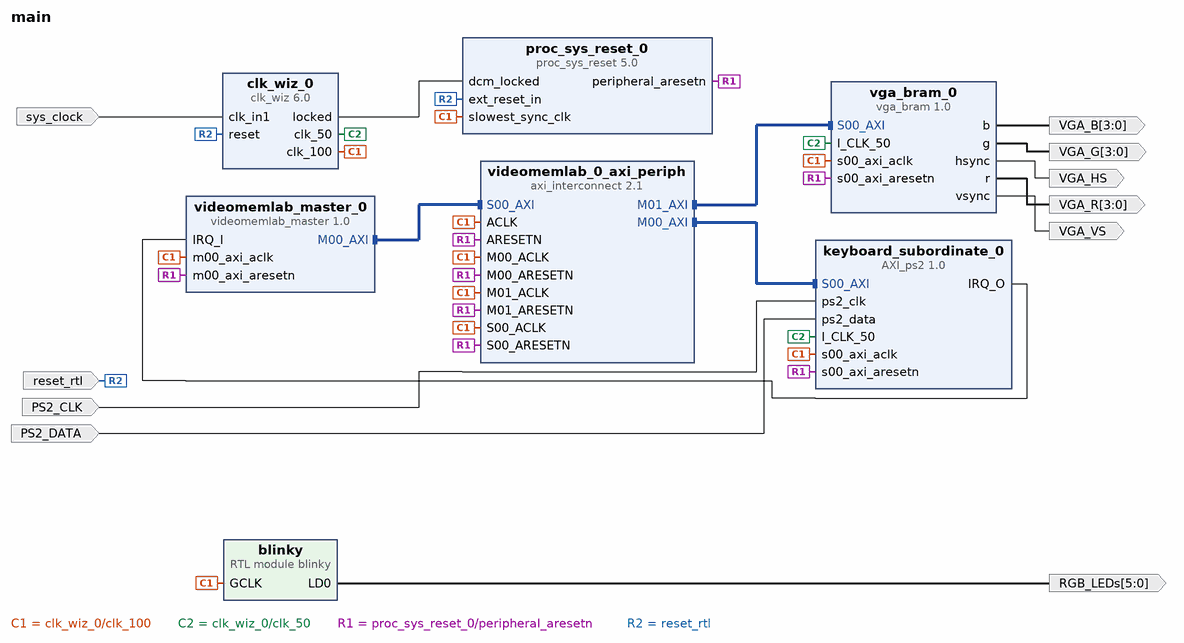
[diagram p0: block diagram of the top level]
# Vivado block design main, xc7z007sclg400-1, Vivado 2022.2
create_bd_design main

create_bd_port -dir I -type rst reset_rtl
set_property -dict {CONFIG.POLARITY ACTIVE_HIGH} [get_bd_ports reset_rtl]
create_bd_port -dir O -from 5 -to 0 RGB_LEDs
create_bd_port -dir I -type clk sys_clock
set_property -dict {CONFIG.FREQ_HZ 125000000 CONFIG.PHASE 0.0} [get_bd_ports sys_clock]
create_bd_port -dir I PS2_CLK
create_bd_port -dir I PS2_DATA
create_bd_port -dir O -from 3 -to 0 VGA_B
create_bd_port -dir O -from 3 -to 0 VGA_G
create_bd_port -dir O -from 3 -to 0 VGA_R
create_bd_port -dir O VGA_VS
create_bd_port -dir O VGA_HS

create_bd_cell -type ip -vlnv xilinx.com:ip:proc_sys_reset:5.0 proc_sys_reset_0
create_bd_cell -type ip -vlnv xilinx.com:ip:clk_wiz:6.0 clk_wiz_0
set_property -dict [list \
  CONFIG.CLKOUT2_JITTER 143.688 \
  CONFIG.CLKOUT2_PHASE_ERROR 96.948 \
  CONFIG.CLKOUT2_REQUESTED_OUT_FREQ 50.000 \
  CONFIG.CLKOUT2_USED true \
  CONFIG.CLKOUT3_JITTER 119.348 \
  CONFIG.CLKOUT3_PHASE_ERROR 96.948 \
  CONFIG.CLKOUT3_REQUESTED_OUT_FREQ 125.000 \
  CONFIG.CLKOUT3_USED true \
  CONFIG.CLK_IN1_BOARD_INTERFACE sys_clock \
  CONFIG.CLK_OUT1_PORT clk_100 \
  CONFIG.CLK_OUT2_PORT clk_50 \
  CONFIG.CLK_OUT3_PORT clk_125 \
  CONFIG.MMCM_CLKOUT1_DIVIDE 20 \
  CONFIG.MMCM_CLKOUT2_DIVIDE 8 \
  CONFIG.NUM_OUT_CLKS 3 \
  CONFIG.USE_BOARD_FLOW true \
] [get_bd_cells clk_wiz_0]
create_bd_cell -type module -reference blinky blinky
set_property -dict [list \
  CONFIG.clk_freq 100000000 \
  CONFIG.out_off_mask 0x00000021 \
  CONFIG.out_on_mask 0x00000017 \
  CONFIG.out_size 6 \
] [get_bd_cells blinky]
create_bd_cell -type ip -vlnv xilinx.com:ip:axi_interconnect:2.1 videomemlab_0_axi_periph
set_property -dict {CONFIG.NUM_MI 2} [get_bd_cells videomemlab_0_axi_periph]
create_bd_cell -type ip -vlnv xilinx.com:user:vga_bram:1.0 vga_bram_0
create_bd_cell -type ip -vlnv xilinx.com:user:videomemlab_master:1.0 videomemlab_master_0
create_bd_cell -type ip -vlnv solathomas.com:Project_6:AXI_ps2:1.0 keyboard_subordinate_0

# ---- connections ----

connect_bd_intf_net [get_bd_intf_pins videomemlab_0_axi_periph/M00_AXI] [get_bd_intf_pins keyboard_subordinate_0/S00_AXI]
connect_bd_intf_net [get_bd_intf_pins videomemlab_0_axi_periph/M01_AXI] [get_bd_intf_pins vga_bram_0/S00_AXI]
connect_bd_intf_net [get_bd_intf_pins videomemlab_master_0/M00_AXI] [get_bd_intf_pins videomemlab_0_axi_periph/S00_AXI]
connect_bd_net [get_bd_ports PS2_CLK] [get_bd_pins keyboard_subordinate_0/ps2_clk]
connect_bd_net [get_bd_ports PS2_DATA] [get_bd_pins keyboard_subordinate_0/ps2_data]
connect_bd_net -net blinky_0_LD0 [get_bd_pins blinky/LD0] [get_bd_ports RGB_LEDs]
connect_bd_net -net clk_wiz_0_clk_out1 [get_bd_pins clk_wiz_0/clk_100] \
  [get_bd_pins proc_sys_reset_0/slowest_sync_clk] [get_bd_pins videomemlab_0_axi_periph/ACLK] \
  [get_bd_pins videomemlab_0_axi_periph/S00_ACLK] [get_bd_pins videomemlab_0_axi_periph/M00_ACLK] \
  [get_bd_pins videomemlab_0_axi_periph/M01_ACLK] [get_bd_pins blinky/GCLK] [get_bd_pins vga_bram_0/s00_axi_aclk] \
  [get_bd_pins videomemlab_master_0/m00_axi_aclk] [get_bd_pins keyboard_subordinate_0/s00_axi_aclk]
connect_bd_net -net clk_wiz_0_clk_out2 [get_bd_pins clk_wiz_0/clk_50] [get_bd_pins vga_bram_0/I_CLK_50] [get_bd_pins keyboard_subordinate_0/I_CLK_50]
connect_bd_net [get_bd_pins clk_wiz_0/locked] [get_bd_pins proc_sys_reset_0/dcm_locked]
connect_bd_net [get_bd_pins keyboard_subordinate_0/IRQ_O] [get_bd_pins videomemlab_master_0/IRQ_I]
connect_bd_net [get_bd_pins proc_sys_reset_0/peripheral_aresetn] \
  [get_bd_pins videomemlab_0_axi_periph/S00_ARESETN] [get_bd_pins videomemlab_0_axi_periph/M00_ARESETN] \
  [get_bd_pins videomemlab_0_axi_periph/ARESETN] [get_bd_pins videomemlab_0_axi_periph/M01_ARESETN] \
  [get_bd_pins vga_bram_0/s00_axi_aresetn] [get_bd_pins videomemlab_master_0/m00_axi_aresetn] \
  [get_bd_pins keyboard_subordinate_0/s00_axi_aresetn]
connect_bd_net [get_bd_ports reset_rtl] [get_bd_pins proc_sys_reset_0/ext_reset_in] [get_bd_pins clk_wiz_0/reset]
connect_bd_net [get_bd_ports sys_clock] [get_bd_pins clk_wiz_0/clk_in1]
connect_bd_net [get_bd_pins vga_bram_0/b] [get_bd_ports VGA_B]
connect_bd_net [get_bd_pins vga_bram_0/g] [get_bd_ports VGA_G]
connect_bd_net [get_bd_pins vga_bram_0/hsync] [get_bd_ports VGA_HS]
connect_bd_net [get_bd_pins vga_bram_0/r] [get_bd_ports VGA_R]
connect_bd_net [get_bd_pins vga_bram_0/vsync] [get_bd_ports VGA_VS]

# ---- address map ----
assign_bd_address -offset 0x44A00000 -range 64K -target_address_space [get_bd_addr_spaces videomemlab_master_0/M00_AXI] [get_bd_addr_segs keyboard_subordinate_0/S00_AXI/S00_AXI_reg]
assign_bd_address -offset 0x44A10000 -range 64K -target_address_space [get_bd_addr_spaces videomemlab_master_0/M00_AXI] [get_bd_addr_segs vga_bram_0/S00_AXI/S00_AXI_reg]

validate_bd_design
save_bd_design
